# EasyEDA Pro project Solkatstice_v1.1_2025-04-18.epro, schematic Solkatstice
Board Name: Solkatstice; Create Date: 2025-03-18; Page Name: Solkatstice; Project Name: Solkatstice2; Schematic Name: Solkatstice; Update Date: 2025-03-18; File: Solkatstice; Id: /; Sheet: /
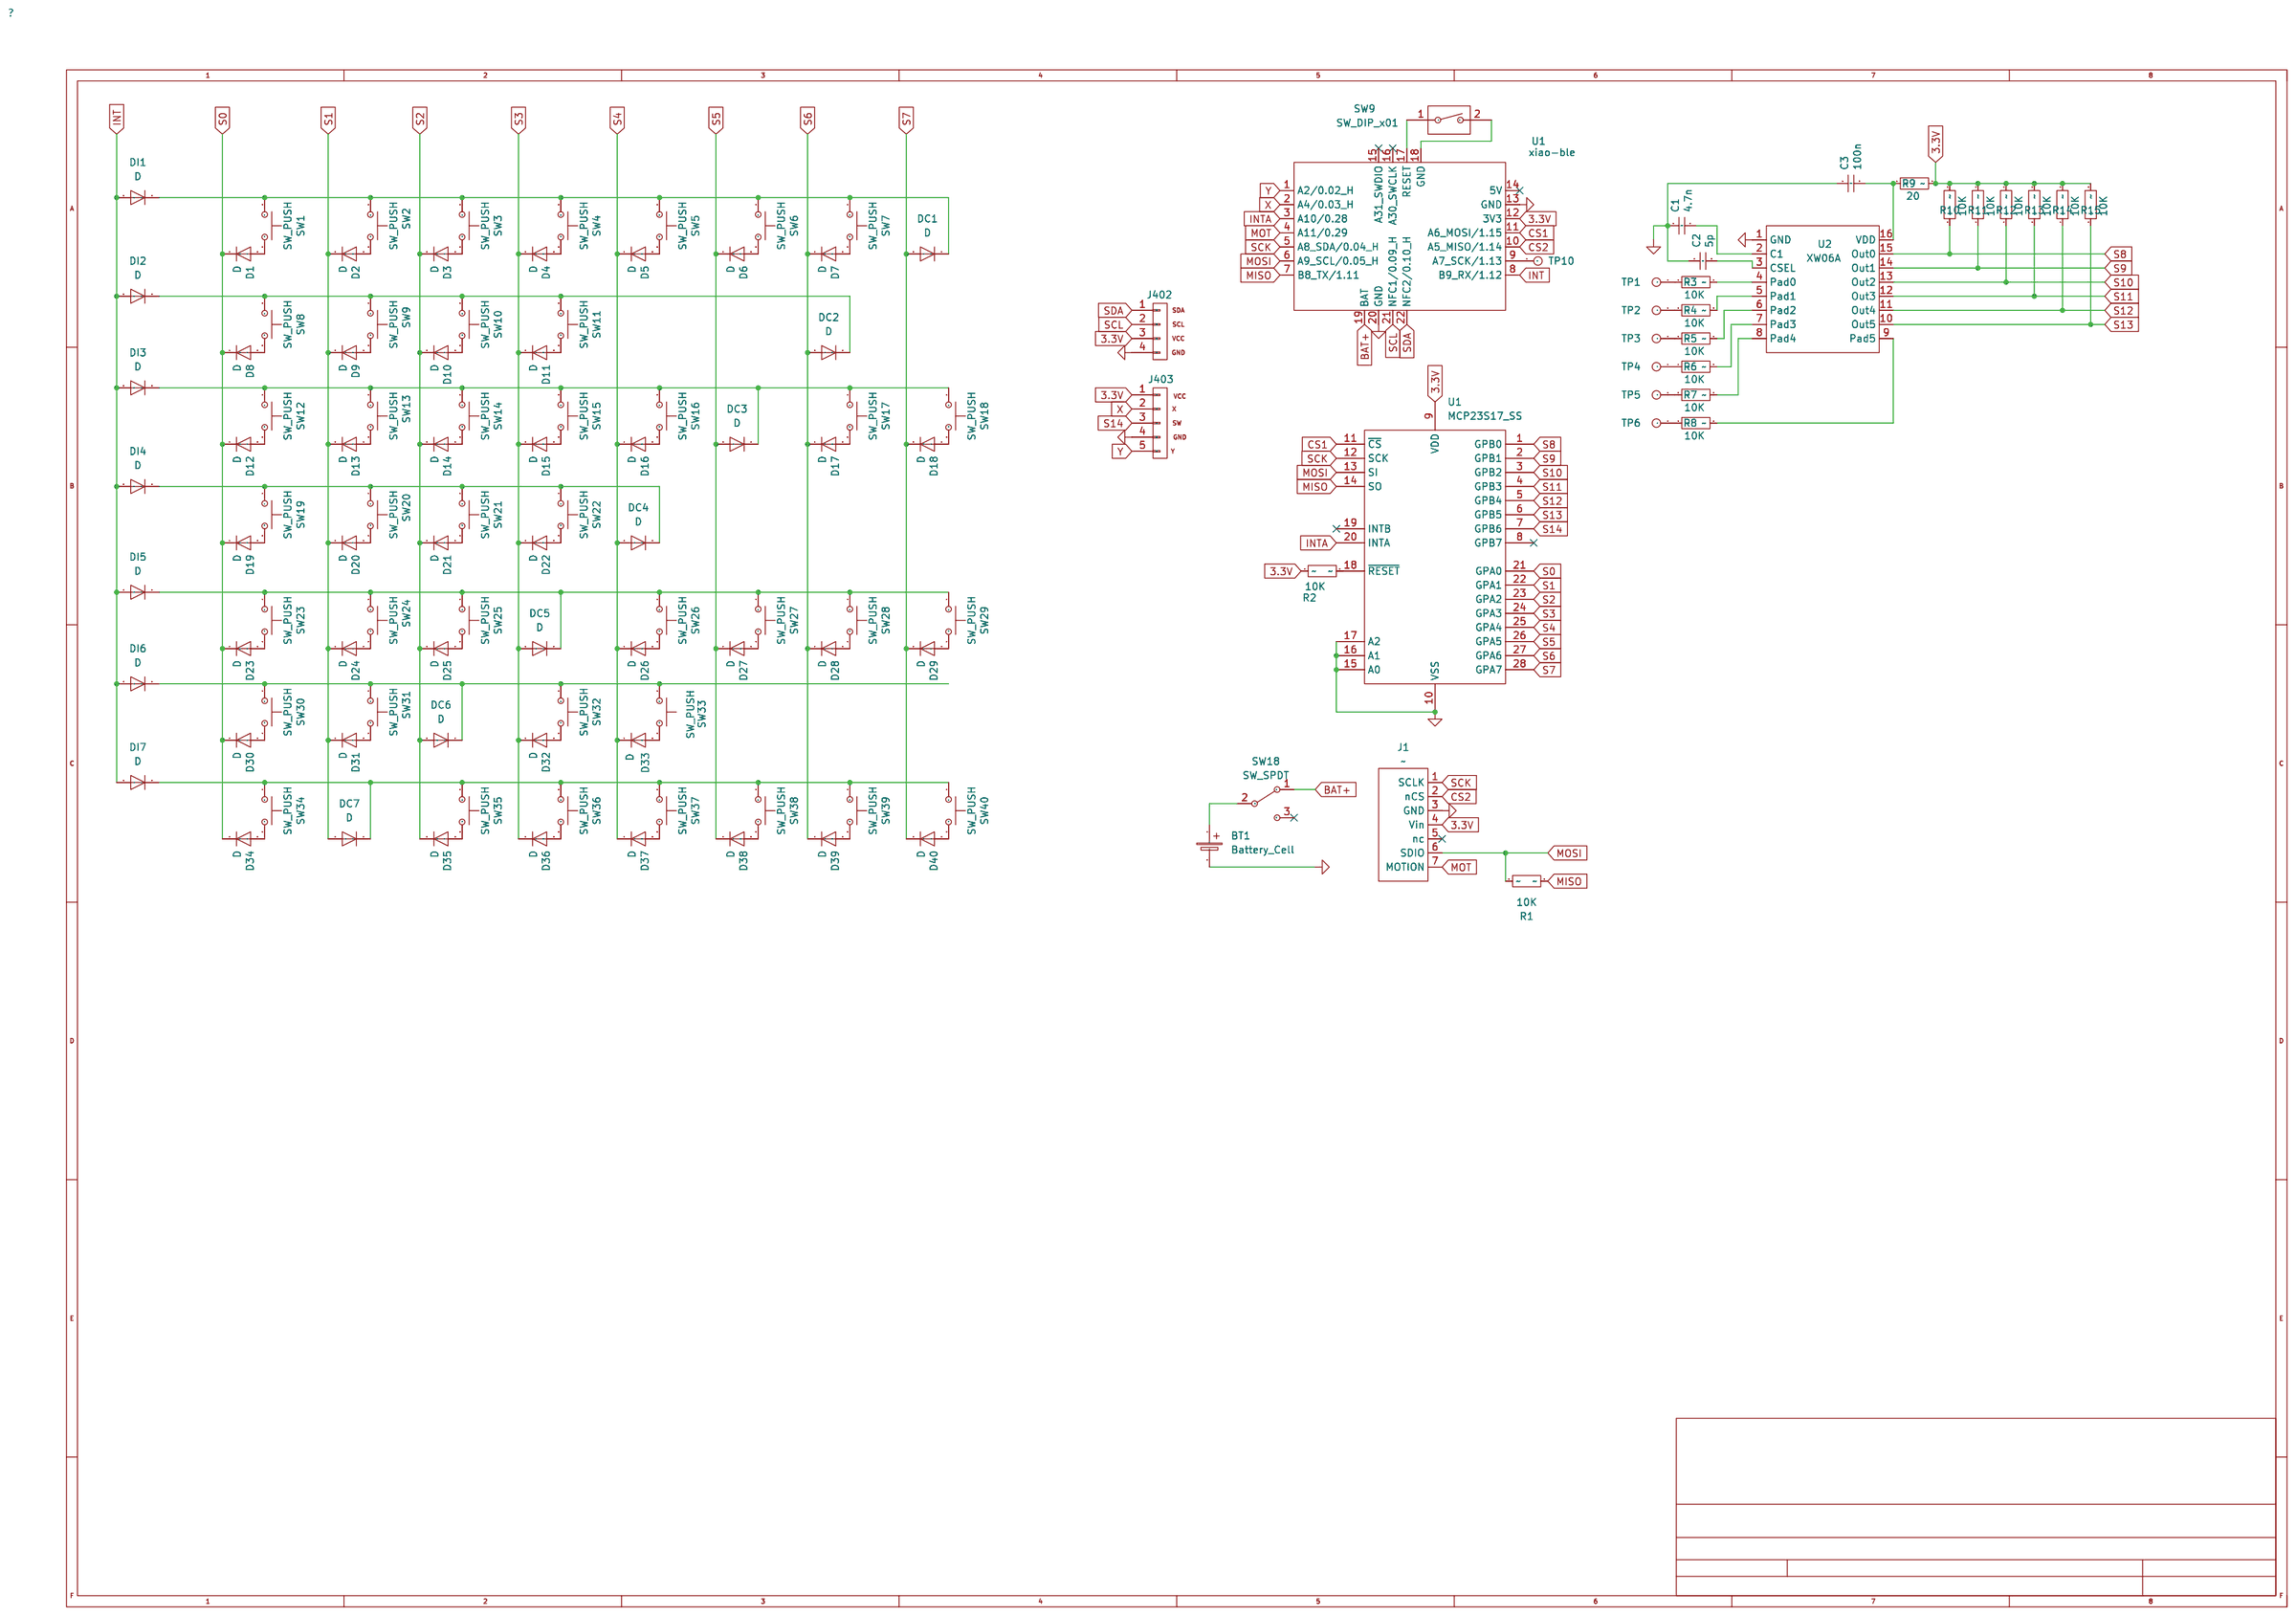
[diagram p0: schematic sheet]

## Parts
BT1  Battery_Cell  [kbd_Parts:Battery_2pin]
C1  4.7n  [Capacitor_SMD:C_0603_1608Metric]
C2  5p  [Capacitor_SMD:C_0603_1608Metric]
C3  100n  [Capacitor_SMD:C_0603_1608Metric]
D1  D  [Diode_SMD:D_SOD-123]
D2  D  [Diode_SMD:D_SOD-123]
D3  D  [Diode_SMD:D_SOD-123]
D4  D  [Diode_SMD:D_SOD-123]
D5  D  [Diode_SMD:D_SOD-123]
D6  D  [Diode_SMD:D_SOD-123]
D7  D  [Diode_SMD:D_SOD-123]
D8  D  [Diode_SMD:D_SOD-123]
D9  D  [Diode_SMD:D_SOD-123]
D10  D  [Diode_SMD:D_SOD-123]
D11  D  [Diode_SMD:D_SOD-123]
D12  D  [Diode_SMD:D_SOD-123]
D13  D  [Diode_SMD:D_SOD-123]
D14  D  [Diode_SMD:D_SOD-123]
D15  D  [Diode_SMD:D_SOD-123]
D16  D  [Diode_SMD:D_SOD-123]
D17  D  [Diode_SMD:D_SOD-123]
D18  D  [Diode_SMD:D_SOD-123]
D19  D  [Diode_SMD:D_SOD-123]
D20  D  [Diode_SMD:D_SOD-123]
D21  D  [Diode_SMD:D_SOD-123]
D22  D  [Diode_SMD:D_SOD-123]
D23  D  [Diode_SMD:D_SOD-123]
D24  D  [Diode_SMD:D_SOD-123]
D25  D  [Diode_SMD:D_SOD-123]
D26  D  [Diode_SMD:D_SOD-123]
D27  D  [Diode_SMD:D_SOD-123]
D28  D  [Diode_SMD:D_SOD-123]
D29  D  [Diode_SMD:D_SOD-123]
D30  D  [Diode_SMD:D_SOD-123]
D31  D  [Diode_SMD:D_SOD-123]
D32  D  [Diode_SMD:D_SOD-123]
D33  D  [Diode_SMD:D_SOD-123]
D34  D  [Diode_SMD:D_SOD-123]
D35  D  [Diode_SMD:D_SOD-123]
D36  D  [Diode_SMD:D_SOD-123]
D37  D  [Diode_SMD:D_SOD-123]
D38  D  [Diode_SMD:D_SOD-123]
D39  D  [Diode_SMD:D_SOD-123]
D40  D  [Diode_SMD:D_SOD-123]
DC1  D  [Diode_SMD:D_SOD-123]
DC2  D  [Diode_SMD:D_SOD-123]
DC3  D  [Diode_SMD:D_SOD-123]
DC4  D  [Diode_SMD:D_SOD-123]
DC5  D  [Diode_SMD:D_SOD-123]
DC6  D  [Diode_SMD:D_SOD-123]
DC7  D  [Diode_SMD:D_SOD-123]
DI1  D  [Diode_SMD:D_SOD-123]
DI2  D  [Diode_SMD:D_SOD-123]
DI3  D  [Diode_SMD:D_SOD-123]
DI4  D  [Diode_SMD:D_SOD-123]
DI5  D  [Diode_SMD:D_SOD-123]
DI6  D  [Diode_SMD:D_SOD-123]
DI7  D  [Diode_SMD:D_SOD-123]
J1  -  [roBa:pmw3610_connector]
J402  Conn_01x08  [display:OLED-128x32]
J403  Conn_01x08  [Connector_Hirose:Hirose_DF3EA-05P-2H_1x05-1MP_P2.00mm_Horizontal]
R1  10K  [Resistor_SMD:R_0603_1608Metric_Pad0.98x0.95mm_HandSolder]
R2  10K  [Resistor_SMD:R_0603_1608Metric_Pad0.98x0.95mm_HandSolder]
R3  10K  [Resistor_SMD:R_0603_1608Metric_Pad0.98x0.95mm_HandSolder]
R4  10K  [Resistor_SMD:R_0603_1608Metric_Pad0.98x0.95mm_HandSolder]
R5  10K  [Resistor_SMD:R_0603_1608Metric_Pad0.98x0.95mm_HandSolder]
R6  10K  [Resistor_SMD:R_0603_1608Metric_Pad0.98x0.95mm_HandSolder]
R7  10K  [Resistor_SMD:R_0603_1608Metric_Pad0.98x0.95mm_HandSolder]
R8  10K  [Resistor_SMD:R_0603_1608Metric_Pad0.98x0.95mm_HandSolder]
R9  20  [Resistor_SMD:R_0603_1608Metric_Pad0.98x0.95mm_HandSolder]
R10  10K  [Resistor_SMD:R_0603_1608Metric_Pad0.98x0.95mm_HandSolder]
R11  10K  [Resistor_SMD:R_0603_1608Metric_Pad0.98x0.95mm_HandSolder]
R12  10K  [Resistor_SMD:R_0603_1608Metric_Pad0.98x0.95mm_HandSolder]
R13  10K  [Resistor_SMD:R_0603_1608Metric_Pad0.98x0.95mm_HandSolder]
R14  10K  [Resistor_SMD:R_0603_1608Metric_Pad0.98x0.95mm_HandSolder]
R15  10K  [Resistor_SMD:R_0603_1608Metric_Pad0.98x0.95mm_HandSolder]
SW1  SW_PUSH  [kbd_SW:CherryMX_Hotswap_1u]
SW2  SW_PUSH  [kbd_SW:CherryMX_Hotswap_1u]
SW3  SW_PUSH  [kbd_SW:CherryMX_Hotswap_1u]
SW4  SW_PUSH  [kbd_SW:CherryMX_Hotswap_1u]
SW5  SW_PUSH  [kbd_SW:CherryMX_Hotswap_1u]
SW6  SW_PUSH  [kbd_SW:CherryMX_Hotswap_1u]
SW7  SW_PUSH  [kbd_SW:CherryMX_Hotswap_1u]
SW8  SW_PUSH  [kbd_SW:CherryMX_Hotswap_1u]
SW9  SW_PUSH  [kbd_SW:CherryMX_Hotswap_1u]
SW9#2  SW_DIP_x01  [kbd_Parts:ResetSW]
SW10  SW_PUSH  [kbd_SW:CherryMX_Hotswap_1u]
SW11  SW_PUSH  [kbd_SW:CherryMX_Hotswap_1u]
SW12  SW_PUSH  [kbd_SW:CherryMX_Hotswap_1u]
SW13  SW_PUSH  [kbd_SW:CherryMX_Hotswap_1u]
SW14  SW_PUSH  [kbd_SW:CherryMX_Hotswap_1u]
SW15  SW_PUSH  [kbd_SW:CherryMX_Hotswap_1u]
SW16  SW_PUSH  [kbd_SW:CherryMX_Hotswap_1u]
SW17  SW_PUSH  [kbd_SW:CherryMX_Hotswap_1u]
SW18  SW_PUSH  [kbd_SW:CherryMX_Hotswap_1u]
SW18#2  SW_SPDT  [Button_Switch_SMD:SW_SPDT_PCM12]
SW19  SW_PUSH  [kbd_SW:CherryMX_Hotswap_1u]
SW20  SW_PUSH  [kbd_SW:CherryMX_Hotswap_1u]
SW21  SW_PUSH  [kbd_SW:CherryMX_Hotswap_1u]
SW22  SW_PUSH  [kbd_SW:CherryMX_Hotswap_1u]
SW23  SW_PUSH  [kbd_SW:CherryMX_Hotswap_1u]
SW24  SW_PUSH  [kbd_SW:CherryMX_Hotswap_1u]
SW25  SW_PUSH  [kbd_SW:CherryMX_Hotswap_1u]
SW26  SW_PUSH  [kbd_SW:CherryMX_Hotswap_1u]
SW27  SW_PUSH  [kbd_SW:CherryMX_Hotswap_1u]
SW28  SW_PUSH  [kbd_SW:CherryMX_Hotswap_1u]
SW29  SW_PUSH  [kbd_SW:CherryMX_Hotswap_1u]
SW30  SW_PUSH  [kbd_SW:CherryMX_Hotswap_1u]
SW31  SW_PUSH  [kbd_SW:CherryMX_Hotswap_1u]
SW32  SW_PUSH  [kbd_SW:CherryMX_Hotswap_1u]
SW33  SW_PUSH  [kbd_SW:CherryMX_Hotswap_1u]
SW34  SW_PUSH  [kbd_SW:CherryMX_Hotswap_1u]
SW35  SW_PUSH  [kbd_SW:CherryMX_Hotswap_1u]
SW36  SW_PUSH  [kbd_SW:CherryMX_Hotswap_1u]
SW37  SW_PUSH  [kbd_SW:CherryMX_Hotswap_1u]
SW38  SW_PUSH  [kbd_SW:CherryMX_Hotswap_1u]
SW39  SW_PUSH  [kbd_SW:CherryMX_Hotswap_1u]
SW40  SW_PUSH  [kbd_SW:CherryMX_Hotswap_1u]
TP1  TestPoint  [TestPoint:TestPoint_Pad_1.0x1.0mm]
TP2  TestPoint  [TestPoint:TestPoint_Pad_1.0x1.0mm]
TP3  TestPoint  [TestPoint:TestPoint_Pad_1.0x1.0mm]
TP4  TestPoint  [TestPoint:TestPoint_Pad_1.0x1.0mm]
TP5  TestPoint  [TestPoint:TestPoint_Pad_1.0x1.0mm]
TP6  TestPoint  [TestPoint:TestPoint_Pad_1.0x1.0mm]
TP10  TestPoint  [TestPoint:TestPoint_THTPad_1.0x1.0mm_Drill0.5mm]
U1  xiao-ble
U1#2  MCP23S17_SS  [Package_SO:SSOP-28_5.3x10.2mm_P0.65mm]
U2  XW06A  [Package_SO:SOP-16_3.9x9.9mm_P1.27mm]

## Library data of the parts
BT1 = Device_Battery_Cell
C1-C3 = Device_C_Small: LCSC: C15849
D1-D40 DC1-DC7 DI1-DI7 = Device_D
J1 = my_pmw3610_breakout
J402 J403 = Connector_Generic_Conn_01x06
R1-R15 = Device_R: Resistor
SW1-SW40 = Switch_SW_Push
SW9#2 = Switch_SW_DIP_x01
SW18#2 = Switch_SW_SPDT
TP1-TP6 TP10 = Connector_TestPoint: test point
U1 = kleeb_xiao-ble
U1#2 = Interface_Expansion_MCP23S17_SS: 16-bit I/O expander, I2C, interrupts, w pull-ups, SSOP-28; User doc link: http://ww1.microchip.com/downloads/en/DeviceDoc/20001952C.pdf
U2 = Driver_Display_ADS7843E: Single-supply, 12bit, 4 ch, touch screen driver, 2.2 - 5.25 VDD, -40 to +85 C, QSPI, SPI, 3-wire serial interface, SSOP-16; User doc link: http://www.ti.com/lit/ds/symlink/ads7843.pdf

## Nets
3.3V: J1.4(Vin) J402.3(Pin) J403.1(Pin) R2.1 R9.2 R10.2 R11.2 R12.2 R13.2 R14.2 R15.2 U1.12(3V3) U1#2.9(VDD)
BAT+: SW18#2.1(A) U1.19(BAT)
CS1: U1.11(A6_MOSI/1.15) U1#2.11(~{CS})
CS2: J1.2(nCS) U1.10(A5_MISO/1.14)
INT: DI1.2(A) DI2.2(A) DI3.2(A) DI4.2(A) DI5.2(A) DI6.2(A) DI7.2(A) U1.8(B9_RX/1.12)
INTA: U1.3(A10/0.28) U1#2.20(INTA)
MISO: R1.1 U1.7(B8_TX/1.11) U1#2.14(SO)
MOSI: J1.6(SDIO) R1.2 U1.6(A9_SCL/0.05_H) U1#2.13(SI)
MOT: J1.7(MOTION) U1.4(A11/0.29)
POWER_GND: BT1.2(-) C1.1 C2.1 C3.1 J1.3(GND) J402.4(Pin) J403.4(Pin) U1.13(GND) U1.20(GND) U1#2.10(VSS) U1#2.15(A0) U1#2.16(A1) U1#2.17(A2) U2.1(GND)
S0: D1.1(K) D8.1(K) D12.1(K) D19.1(K) D23.1(K) D30.1(K) D34.1(K) U1#2.21(GPA0)
S1: D2.1(K) D9.1(K) D13.1(K) D20.1(K) D24.1(K) D31.1(K) DC7.2(A) U1#2.22(GPA1)
S2: D3.1(K) D10.1(K) D14.1(K) D21.1(K) D25.1(K) D35.1(K) DC6.2(A) U1#2.23(GPA2)
S3: D4.1(K) D11.1(K) D15.1(K) D22.1(K) D32.1(K) D36.1(K) DC5.2(A) U1#2.24(GPA3)
S4: D5.1(K) D16.1(K) D26.1(K) D33.1(K) D37.1(K) DC4.2(A) U1#2.25(GPA4)
S5: D6.1(K) D27.1(K) D38.1(K) DC3.2(A) U1#2.26(GPA5)
S6: D7.1(K) D17.1(K) D28.1(K) D39.1(K) DC2.2(A) U1#2.27(GPA6)
S7: D18.1(K) D29.1(K) D40.1(K) DC1.2(A) U1#2.28(GPA7)
S8: R10.1 U1#2.1(GPB0) U2.15(Out0)
S9: R11.1 U1#2.2(GPB1) U2.14(Out1)
S10: R12.1 U1#2.3(GPB2) U2.13(Out2)
S11: R13.1 U1#2.4(GPB3) U2.12(Out3)
S12: R14.1 U1#2.5(GPB4) U2.11(Out4)
S13: R15.1 U1#2.6(GPB5) U2.10(Out5)
S14: J403.3(Pin) U1#2.7(GPB6)
SCK: J1.1(SCLK) U1.5(A8_SDA/0.04_H) U1#2.12(SCK)
SCL: J402.2(Pin) U1.21(NFC1/0.09_H)
SDA: J402.1(Pin) U1.22(NFC2/0.10_H)
X: J403.2(Pin) U1.2(A4/0.03_H)
Y: J403.5(Pin) U1.1(A2/0.02_H)
Net-(BT1-1): BT1.1(+) SW18#2.2(B)
NET-(D1-A): D1.2(A) SW1.2
NET-(D2-A): D2.2(A) SW2.2
NET-(D3-A): D3.2(A) SW3.2
NET-(D4-A): D4.2(A) SW4.2
NET-(D5-A): D5.2(A) SW5.2
NET-(D6-A): D6.2(A) SW6.2
NET-(D7-A): D7.2(A) SW7.2
NET-(D8-A): D8.2(A) SW8.2
NET-(D9-A): D9.2(A) SW9.2
NET-(D10-A): D10.2(A) SW10.2
NET-(D11-A): D11.2(A) SW11.2
NET-(D12-A): D12.2(A) SW12.2
NET-(D13-A): D13.2(A) SW13.2
NET-(D14-A): D14.2(A) SW14.2
NET-(D15-A): D15.2(A) SW15.2
NET-(D16-A): D16.2(A) SW16.2
NET-(D17-A): D17.2(A) SW17.2
NET-(D18-A): D18.2(A) SW18.2
NET-(D19-A): D19.2(A) SW19.2
NET-(D20-A): D20.2(A) SW20.2
NET-(D21-A): D21.2(A) SW21.2
NET-(D22-A): D22.2(A) SW22.2
NET-(D23-A): D23.2(A) SW23.2
NET-(D24-A): D24.2(A) SW24.2
NET-(D25-A): D25.2(A) SW25.2
NET-(D26-A): D26.2(A) SW26.2
NET-(D27-A): D27.2(A) SW27.2
NET-(D28-A): D28.2(A) SW28.2
NET-(D29-A): D29.2(A) SW29.2
NET-(D30-A): D30.2(A) SW30.2
NET-(D31-A): D31.2(A) SW31.2
NET-(D32-A): D32.2(A) SW32.2
NET-(D33-A): D33.2(A) SW33.2
NET-(D34-A): D34.2(A) SW34.2
NET-(D35-A): D35.2(A) SW35.2
NET-(D36-A): D36.2(A) SW36.2
NET-(D37-A): D37.2(A) SW37.2
NET-(D38-A): D38.2(A) SW38.2
NET-(D39-A): D39.2(A) SW39.2
NET-(D40-A): D40.2(A) SW40.2
NET-(DC1-K): DC1.1(K) DI1.1(K) SW1.1 SW2.1 SW3.1 SW4.1 SW5.1 SW6.1 SW7.1
NET-(DC2-K): DC2.1(K) DI2.1(K) SW8.1 SW9.1 SW10.1 SW11.1
NET-(DC3-K): DC3.1(K) DI3.1(K) SW12.1 SW13.1 SW14.1 SW15.1 SW16.1 SW17.1 SW18.1
NET-(DC4-K): DC4.1(K) DI4.1(K) SW19.1 SW20.1 SW21.1 SW22.1
NET-(DC5-K): DC5.1(K) DI5.1(K) SW23.1 SW24.1 SW25.1 SW26.1 SW27.1 SW28.1 SW29.1
NET-(DC6-K): DC6.1(K) DI6.1(K) SW30.1 SW31.1 SW32.1 SW33.1
NET-(DC7-K): DC7.1(K) DI7.1(K) SW34.1 SW35.1 SW36.1 SW37.1 SW38.1 SW39.1 SW40.1
Net-(R2-2): R2.2 U1#2.18(~{RESET})
NET-(R3-PAD1): R3.1 TP1.1
NET-(R3-PAD2): R3.2 U2.4(Pad0)
NET-(R4-PAD1): R4.1 TP2.1
NET-(R4-PAD2): R4.2 U2.5(Pad1)
NET-(R5-PAD1): R5.1 TP3.1
NET-(R5-PAD2): R5.2 U2.6(Pad2)
NET-(R6-PAD1): R6.1 TP4.1
NET-(R6-PAD2): R6.2 U2.7(Pad3)
NET-(R7-PAD1): R7.1 TP5.1
NET-(R7-PAD2): R7.2 U2.8(Pad4)
NET-(R8-PAD1): R8.1 TP6.1
NET-(R8-PAD2): R8.2 U2.9(Pad5)
Net-(SW9#2-1): SW9#2.1 U1.17(RESET)
Net-(SW9#2-2): SW9#2.2 U1.18(GND)
Net-(TP10-1): TP10.1 U1.9(A7_SCK/1.13)
NET-(U2-C1): C1.2 U2.2(C1)
NET-(U2-CSEL): C2.2 U2.3(CSEL)
NET-(U2-VDD): C3.2 R9.1 U2.16(VDD)

Not connected (* = marked no-connect by the designer): J1 5(nc)*; SW18#2 3(C)*; U1 14(5V)* 15(A31_SWDIO)* 16(A30_SWCLK)*; U1#2 8(GPB7)* 19(INTB)*
